# Altium schematic sheet [6]-PEAKMETER_LEDS.SchDoc: [6]-PEAKMETER_LEDS
size A3; DocumentNumber: 6; Revision: 01-01-2020; SheetNumber: 6; SheetTotal: 6
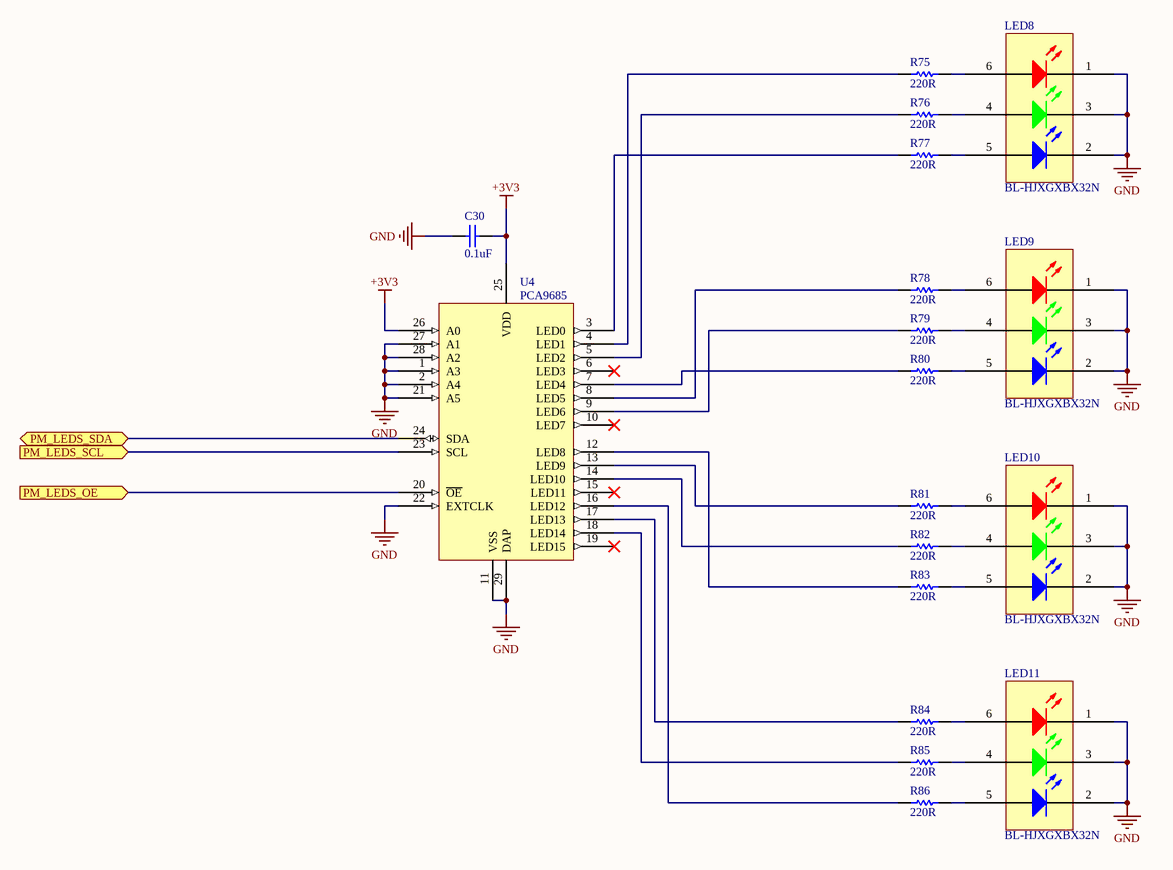
[diagram p0: [6]-PEAKMETER_LEDS.SchDoc]

## Parts
C30  0.1uF  [CAPC1608N]
LED8  BL-HJXGXBX32N  [BL-HJXGXBX32N]
LED9  BL-HJXGXBX32N  [BL-HJXGXBX32N]
LED10  BL-HJXGXBX32N  [BL-HJXGXBX32N]
LED11  BL-HJXGXBX32N  [BL-HJXGXBX32N]
R75  220R  [RESC1608N]
R76  220R  [RESC1608N]
R77  220R  [RESC1608N]
R78  220R  [RESC1608N]
R79  220R  [RESC1608N]
R80  220R  [RESC1608N]
R81  220R  [RESC1608N]
R82  220R  [RESC1608N]
R83  220R  [RESC1608N]
R84  220R  [RESC1608N]
R85  220R  [RESC1608N]
R86  220R  [RESC1608N]
U4  PCA9685  [SOT788-1]

## Ports
PM_LEDS_OE (in), PM_LEDS_SCL (in), PM_LEDS_SDA (bidir)

## Nets
+3V3: C30.1 U4.25(VDD) U4.26(A0)
GND: C30.2 LED8.1 LED8.2 LED8.3 LED9.1 LED9.2 LED9.3 LED10.1 LED10.2 LED10.3 LED11.1 LED11.2 LED11.3 U4.1(A3) U4.2(A4) U4.11(VSS) U4.21(A5) U4.22(EXTCLK) U4.27(A1) U4.28(A2) U4.29(DAP)
PM_LEDS_OE: U4.20(~{OE}) ; port PM_LEDS_OE
PM_LEDS_SCL: U4.23(SCL) ; port PM_LEDS_SCL
PM_LEDS_SDA: U4.24(SDA) ; port PM_LEDS_SDA
NetLED8_4: LED8.4 R76.2
NetLED8_5: LED8.5 R77.2
NetLED8_6: LED8.6 R75.2
NetLED9_4: LED9.4 R79.2
NetLED9_5: LED9.5 R80.2
NetLED9_6: LED9.6 R78.2
NetLED10_4: LED10.4 R82.2
NetLED10_5: LED10.5 R83.2
NetLED10_6: LED10.6 R81.2
NetLED11_4: LED11.4 R85.2
NetLED11_5: LED11.5 R86.2
NetLED11_6: LED11.6 R84.2
NetR75_1: R75.1 U4.4(LED1)
NetR76_1: R76.1 U4.5(LED2)
NetR77_1: R77.1 U4.3(LED0)
NetR78_1: R78.1 U4.8(LED5)
NetR79_1: R79.1 U4.9(LED6)
NetR80_1: R80.1 U4.7(LED4)
NetR81_1: R81.1 U4.13(LED9)
NetR82_1: R82.1 U4.14(LED10)
NetR83_1: R83.1 U4.12(LED8)
NetR84_1: R84.1 U4.17(LED13)
NetR85_1: R85.1 U4.18(LED14)
NetR86_1: R86.1 U4.16(LED12)

Not connected (* = marked no-connect by the designer): U4 6(LED3)* 10(LED7)* 15(LED11)* 19(LED15)*

## Library data of the parts
C30 = CC0603KRX7R8BB104: CAP CER 0.1UF 25V X7R 0603; Manufacturer 1: Yageo; Capacitance: 100nF; Tolerance: 10%; Supplier 1: Digi-Key; Manufacturer Part Number 1: CC0603KRX7R8BB104; Stock 1: 40000; Pricing 1: 1=0.1, 10=0.074, 100=0.0329, 500=0.02352, 1000=0.01848 (USD); Mount: Surface Mount; Case/Package: 0603; Number of Pins: 2; Case Code (Imperial): 0603; Case Code (Metric): 1608; Min Operating Temperature: -55°C; Max Operating Temperature: 125°C; Dielectric: X7R; Voltage Rating: 25V; Packaging: Tape and Reel; Package Quantity: 1; Voltage Rating (DC): 25V; Termination: SMD/SMT; Composition: Ceramic; Voltage: 25V; Length: 1.6mm; Height: 0.8mm; Width: 0.8mm; Thickness: 0.035inch; Depth: 0.8mm; Radiation Hardening: No; REACH SVHC: Unknown; Lead Free: Lead Free; Halogen Free: Halogen Free; ComponentLink1URL: https://datasheet.ciiva.com/11786/0900766b80c10176-11786120.pdf; ComponentLink1Description: https://datasheet.ciiva.com/11786/0900766b80c10176-11786120.pdf; ComponentLink2URL: https://datasheet.ciiva.com/144/mlccorderingcode-144075.pdf; ComponentLink2Description: https://datasheet.ciiva.com/144/mlccorderingcode-144075.pdf; ComponentLink3URL: https://datasheet.ciiva.com/17434/upy-gphc-x7r-6-3v-to-50v-8-17434263.pdf; ComponentLink3Description: https://datasheet.ciiva.com/17434/upy-gphc-x7r-6-3v-to-50v-8-17434263.pdf; ComponentLink4URL: https://datasheet.ciiva.com/26829/getdatasheetpartid-403577-26829431.pdf; ComponentLink4Description: https://datasheet.ciiva.com/26829/getdatasheetpartid-403577-26829431.pdf; ComponentLink5URL: https://datasheet.ciiva.com/11587/upy-gphc-x7r-6-3v-to-50v-8-11587208.pdf; ComponentLink5Description: https://datasheet.ciiva.com/11587/upy-gphc-x7r-6-3v-to-50v-8-11587208.pdf; ComponentLink6URL: https://datasheet.ciiva.com/13389/upy-gphc-x7r-6-3v-to-50v-8-13389352.pdf; ComponentLink6Description: https://datasheet.ciiva.com/13389/upy-gphc-x7r-6-3v-to-50v-8-13389352.pdf; ComponentLink7URL: https://datasheet.ciiva.com/28450/1489800-28450584.pdf; ComponentLink7Description: https://datasheet.ciiva.com/28450/1489800-28450584.pdf; ComponentLink8URL: https://datasheet.ciiva.com/144/mlccorderingcode-144073.pdf; ComponentLink8Description: https://datasheet.ciiva.com/144/mlccorderingcode-144073.pdf; ComponentLink9URL: https://datasheet.ciiva.com/144/mlccorderingcode-144074.pdf; ComponentLink9Description: https://datasheet.ciiva.com/144/mlccorderingcode-144074.pdf; ComponentLink10URL: https://datasheet.ciiva.com/7978/1489800-7978155.pdf; ComponentLink10Description: https://datasheet.ciiva.com/7978/1489800-7978155.pdf; Supplier Part Number 1: 311-1341-1-ND
LED8-LED11 = BL-HJXGXBX32N: LED RGB 6PLCC SMD; Manufacturer 1: American Bright; Supplier 1: Digi-Key; Manufacturer Part Number 1: BL-HJXGXBX32N; Stock 1: 23855; Pricing 1: 1=0.59000, 10=0.42700, 100=0.27880, 500=0.20040, 1000=0.15683 (USD); RoHS: No; Packaging: Cut Tape; Supplier Part Number 1: BL-HJXGXBX32NCT-ND
R75-R86 = CRCW0603220RJNEA: RES SMD 220 OHM 5% 1/10W 0603; Manufacturer 1: Vishay; Power Rating: 100mW; Temperature Coefficient: 200ppm/°C; Voltage Rating: 75V; Supplier 1: Digi-Key; Manufacturer Part Number 1: CRCW0603220RJNEA; Stock 1: 284000; Pricing 1: 1=0.1, 10=0.031, 100=0.0125, 1000=0.00563, 2500=0.00488 (USD); Mount: Surface Mount; Case/Package: 0603; Weight: 7.1E-05oz; Case Code (Metric): 1608; Case Code (Imperial): 0603; Contact Plating: Tin; Min Operating Temperature: -55°C; Max Operating Temperature: 155°C; Resistance: 220R; Tolerance: 5%; Packaging: Tape and Reel; Composition: Thick Film; Package Quantity: 1; Number of Terminations: 2; Max Power Dissipation: 100mW; Military Standard: Not; Termination: SMD/SMT; Features: Automotive AEC-Q200; Working Voltage: 75V; Length: 1.55mm; Height: 0.45mm; Width: 0.033inch; Depth: 0.85mm; Radiation Hardening: No; REACH SVHC: Unknown; ComponentLink1URL: https://datasheet.ciiva.com/2524/dcrcwe3-2524384.pdf; ComponentLink1Description: https://datasheet.ciiva.com/2524/dcrcwe3-2524384.pdf; ComponentLink2URL: https://datasheet.ciiva.com/2524/dcrcwe3-2524385.pdf; ComponentLink2Description: https://datasheet.ciiva.com/2524/dcrcwe3-2524385.pdf; ComponentLink3URL: https://datasheet.ciiva.com/2524/dcrcwe3-2524386.pdf; ComponentLink3Description: https://datasheet.ciiva.com/2524/dcrcwe3-2524386.pdf; ComponentLink4URL: https://datasheet.ciiva.com/8339/dcrcwe3-8339958.pdf; ComponentLink4Description: https://datasheet.ciiva.com/8339/dcrcwe3-8339958.pdf; ComponentLink5URL: https://datasheet.ciiva.com/22869/70201119-22869142.pdf; ComponentLink5Description: https://datasheet.ciiva.com/22869/70201119-22869142.pdf; ComponentLink6URL: https://datasheet.ciiva.com/46448/1807946-46448601.pdf; ComponentLink6Description: https://datasheet.ciiva.com/46448/1807946-46448601.pdf; ComponentLink7URL: https://datasheet.ciiva.com/5550/dcrcwe3-109170-5550730.pdf; ComponentLink7Description: https://datasheet.ciiva.com/5550/dcrcwe3-109170-5550730.pdf; Supplier Part Number 1: 541-220GCT-ND
U4 = IC_PCA9685BS,118: IC LED DRVR LIN DIM 25MA 28HVQFN; Manufacturer 1: NXP Semiconductors; Number of Outputs: 16; Frequency: 50MHz; Output Voltage: 5.5V; Supplier 1: Digi-Key; Manufacturer Part Number 1: PCA9685BS,118; Stock 1: 4307; Pricing 1: 1=2.46, 10=2.205, 100=1.7727, 500=1.45642, 1000=1.20675 (USD); Mount: Surface Mount; Case/Package: VQFN; Number of Pins: 28; Contact Plating: Gold; Min Operating Temperature: -40°C; Max Operating Temperature: 85°C; Packaging: Tape and Reel; Package Quantity: 1; Radiation Hardening: No; ComponentLink1URL: https://datasheet.ciiva.com/12278/pca9685-62190-12278354.pdf; ComponentLink1Description: https://datasheet.ciiva.com/12278/pca9685-62190-12278354.pdf; ComponentLink2URL: https://datasheet.ciiva.com/8125/pca9685-8125351.pdf; ComponentLink2Description: https://datasheet.ciiva.com/8125/pca9685-8125351.pdf; ComponentLink3URL: https://datasheet.ciiva.com/1945/pca9685-1945099.pdf; ComponentLink3Description: https://datasheet.ciiva.com/1945/pca9685-1945099.pdf; ComponentLink4URL: https://datasheet.ciiva.com/1945/pca9685-1945100.pdf; ComponentLink4Description: https://datasheet.ciiva.com/1945/pca9685-1945100.pdf; ComponentLink5URL: https://datasheet.ciiva.com/1945/pca9685-1945101.pdf; ComponentLink5Description: https://datasheet.ciiva.com/1945/pca9685-1945101.pdf; Supplier Part Number 1: 568-5305-1-ND